# Altium project SensorsBoard.PrjPcb
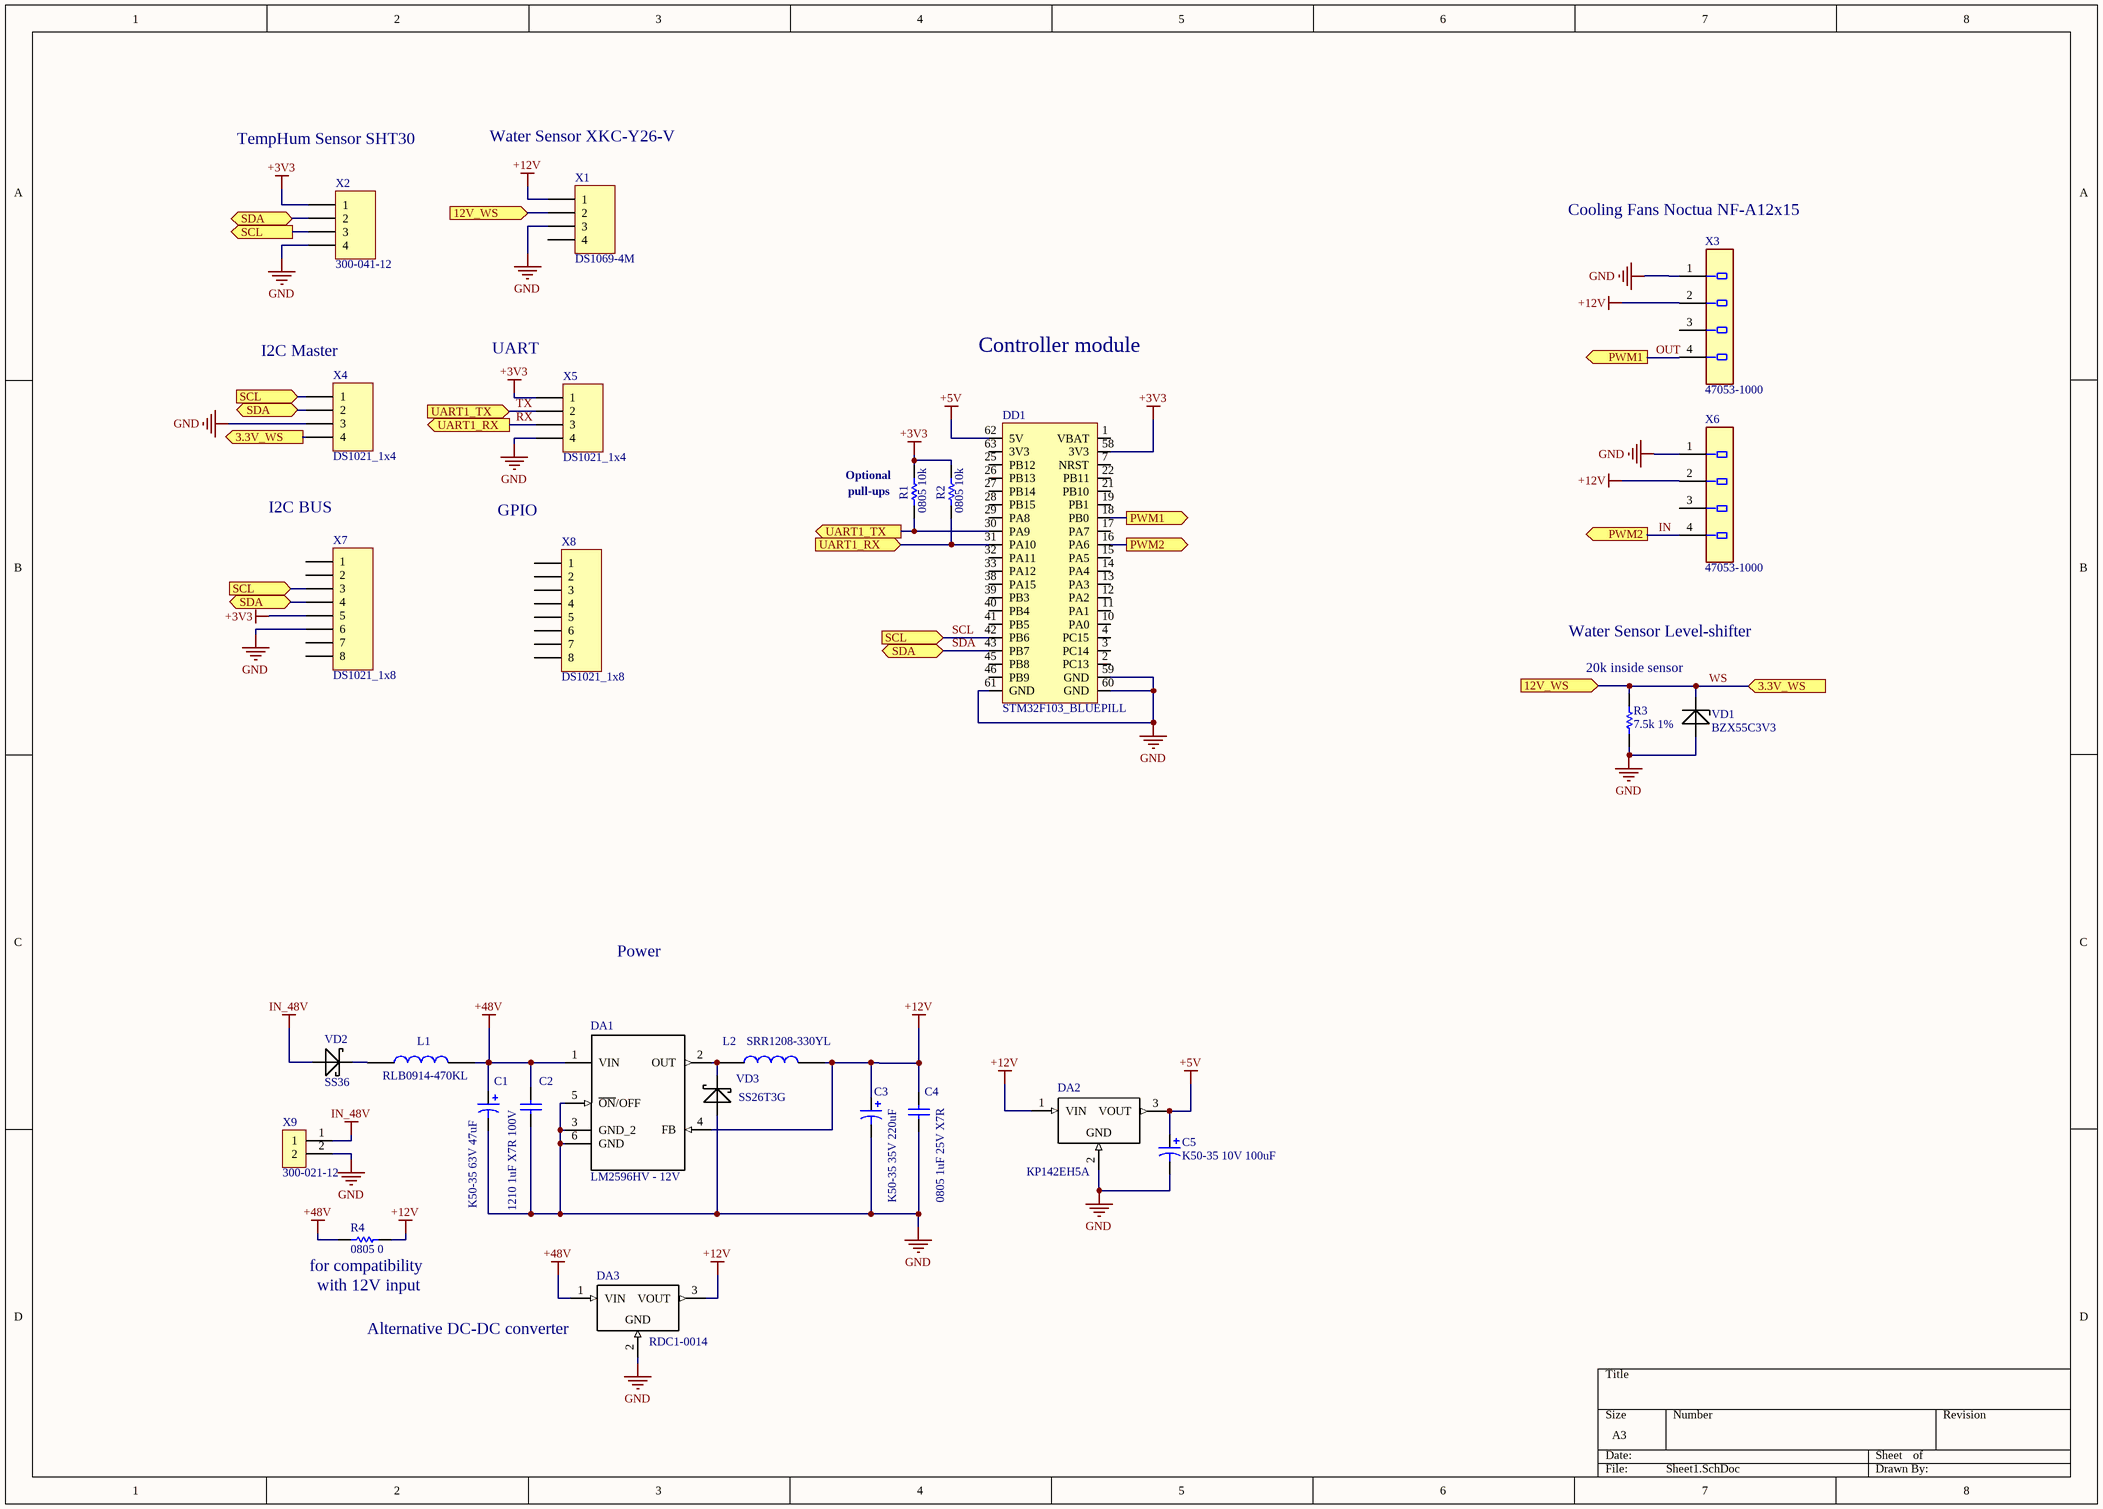
[diagram p0: Sheet1.SchDoc]
1 sheet, 27 parts. Net scope: flat (ports and power ports of the same name join across sheets).
Board files: PCB_THR.PcbDoc, PCB_DIY.PcbDoc, PCB_DIY_Board.PcbDoc

## Sheet Sheet1.SchDoc
size A3

### Parts
C1  K50-35 63V 47uF  [K50-35 6.3x11x2.5]
C2  1210 1uF X7R 100V  [C_SMD1210]
C3  K50-35 35V 220uF  [K50-35 8x11.5x3.5]
C4  0805 1uF 25V X7R  [C_SMD0805]
C5  K50-35 10V 100uF  [K50-35 5x11x2]
DA1  LM2596HV - 12V  [TO263-5 - heatsink]
DA2  КР142ЕН5А  [TO-220-short]
DA3  RDC1-0014  [RDC1-0014]
DD1  STM32F103_BLUEPILL  [STM32F103_BLUEPILL]
L1  RLB0914-470KL  [RLB0914]
L2  SRR1208-330YL  [SRR1208]
R1  0805 10k  [R_SMD0805]
R2  0805 10k  [R_SMD0805]
R3  7.5k 1%  [THROU_HOLE2.54]
R4  0805 0  [R_SMD0805]
VD1  BZX55C3V3  [THROU_HOLE2.54]
VD2  SS36  [DO214AB SMC]
VD3  SS26T3G  [DO-214AA]
X1  DS1069-4M  [DS1069-4 CWF-4 CONNFLY]
X2  300-041-12  [300-041-12]
X3  Part Number: 47053-1000  [Molex_47053-1000_0]  (hidden comment: Conn_Molex_47053-1000_eec)
X4  DS1021_1x4  [PLD1X4]
X5  DS1021_1x4  [PLD1X4]
X6  Part Number: 47053-1000  [Molex_47053-1000_0]
X7  DS1021_1x8  [PLD1x8]
X8  DS1021_1x8  [PLD1x8]
X9  300-021-12  [300-021-12]

### Ports
3.3V_WS (in), 3.3V_WS (out), 12V_WS (in), PWM1 (out), PWM2 (out), SCL (in), SCL (out), SDA (bidir), UART1_RX (in), UART1_RX (out), UART1_TX (in), UART1_TX (out)

### Nets
+3V3: DD1.58(3V3) R1.1 R2.1 X2.1 X5.1 X7.5
+5V: C5.1 DA2.3(VOUT) DD1.62(5V)
+12V: C3.1 C4.2 DA1.4(FB) DA2.1(VIN) DA3.3(VOUT) L2.2 R4.1 X1.1 X3.2 X6.2
+48V: C1.1 C2.2 DA1.1(VIN) DA3.1(VIN) L1.2 R4.2
GND: C1.2 C2.1 C3.2 C4.1 C5.2 DA1.3(GND_2) DA1.5(~{ON}/OFF) DA1.6(GND) DA2.2(GND) DA3.2(GND) DD1.59(GND) DD1.60(GND) DD1.61(GND) R3.1 VD1.1(POS) VD3.2(POS) X1.3 X2.4 X3.1 X4.3 X5.4 X6.1 X7.6 X9.2
IN_48V: VD2.1(POS) X9.1
IN: DD1.16(PA6) X6.4 ; port PWM2
OUT: DD1.18(PB0) X3.4 ; port PWM1
RX: DD1.31(PA10) R2.2 X5.3 ; port UART1_RX
SCL: DD1.42(PB6) X2.3 X4.1 X7.3 ; port SCL
SDA: DD1.43(PB7) X2.2 X4.2 X7.4 ; port SDA
TX: DD1.30(PA9) R1.2 X5.2 ; port UART1_TX
WS: R3.2 VD1.2(NEG) X1.2 X4.4 ; port 12V_WS, port 3.3V_WS
NetDA1_2: DA1.2(OUT) L2.1 VD3.1(NEG)
NetL1_1: L1.1 VD2.2(NEG)

Not connected (* = marked no-connect by the designer): DD1 1(VBAT) 2(PC13) 3(PC14) 4(PC15) 7(NRST) 10(PA0) 11(PA1) 12(PA2) 13(PA3) 14(PA4) 15(PA5) 17(PA7) 19(PB1) 21(PB10) 22(PB11) 25(PB12) 26(PB13) 27(PB14) 28(PB15) 29(PA8) 32(PA11) 33(PA12) 38(PA15) 39(PB3) 40(PB4) 41(PB5) 45(PB8) 46(PB9) 63(3V3); X1 4; X3 3; X6 3; X7 1 2 7 8; X8 1 2 3 4 5 6 7 8

### Notes on the sheet
- TempHum Sensor SHT30
- (near X1) Water Sensor XKC-Y26-V
- Cooling Fans Noctua NF-A12x15
- (near X4) I2C Master
- (near X5) UART
- Controller module
- I2C BUS
- GPIO
- (near R1) Optional
- (near R1) pull-ups
- Water Sensor Level-shifter
- 20k inside sensor
- Power
- (near R4) for compatibility
- (near R4) with 12V input
- (near DA3) Alternative DC-DC converter

### Library data of the parts
C1 C3 C5 = K50-35mini: Конденсатор электролитический алюминиевый
C2 = C1210: Cap SMD1210
C4 = C0805: SMD Cap 0805
DA1 = LM2596HV: SIMPLE SWITCHER4; 4V to 60V, 3A Low Component Count Step-Down Regulator
DA2 = КР142ЕН5А: Cтабилизатор напряжения положительной полярности с выходным / напряжением 5 В
DA3 = RDC1-0014: Встраиваемый DC/DC преобразователь 60В 3А
L1 = RLB0914: Радиальные выводные индуктивности / Диапазон рабочих температур –20 °С… +80 °С. / Рост температуры в процессе эксплуатации, не более 20 °С. / Диапазон индуктивностей 1 - 82000 мкГ
L2 = SRR1208-682KL: Fixed Inductors 6800uH 10% SMD 1208
R1 R2 R4 = R0805: SMD Res 0805
R3 = RES_THROUHOLE: Throu hole resistor
VD1 = BZX55C3V3: Stabilitron 3.3V
VD2 = SS36: Rectifier, Schottky; DO-214AB; 3.0A IF; 0.75V; 60V; 100A IFRM; 10000V/us; 1000pF
VD3 = SS26T3G: Диод Шоттки 2А 60В [SMB / DO-214AA]
X1 = DS1069-4: Вилка на плату 2.50мм
X2 = 300-041-12: Клеммник винтовой, 4-контактный, 5мм, прямой
X3 = Conn_Molex_47053-1000_eec: CONN 4 Positions Header, Unshrouded Connector 0.100" (2.54mm) Through Hole Tin; Manufacturer: Molex; Voltage: 250V; Current: 4.0A; helpURL: https://upverter.com/upn/revision/17f438354fec4bac/; ComponentLink2Description: Datasheet; Temperature: 0°C to +75°C; Package: CONN_4P254L; Supplier 2: Mouser; Supplier 1: Digi-Key; ComponentLink1URL: https://upverter.com/upn/revision/17f438354fec4bac/; Supplier Part Number 2: 538-47053-1000; Supplier Part Number 1: WM4330-ND; ComponentLink1Description: Upverter; ComponentLink2URL: http://www.molex.com/webdocs/datasheets/pdf/en-us//0470531000_PCB_HEADERS.pdf; RoHS: TRUE; Mouser Part Number: 538-47053-1000; Ipc Land Pattern Name: HDRV4W65P_1X4_1020X65X1350; Temperature Range High: +75°C; Digikey Description: CONN 4 Positions Header, Unshrouded Connector 0.100" (2.54mm) Through Hole Tin; Digikey Part Number: WM4330-ND; Temperature Range Low: 0°C; Lead Free: yes; Contact Type: Male Pin; Mounting Style: Through Hole; Pitch: 2.54mm
X4 X5 = DS1021_1x4: Вилка штыревая 2.54мм 1x4 прямая тип1
X6 = 47053-1000: CONN 4 Positions Header, Unshrouded Connector 0.100" (2.54mm) Through Hole Tin; Manufacturer: Molex; Voltage: 250V; Current: 4.0A; helpURL: https://upverter.com/upn/revision/17f438354fec4bac/; ComponentLink2Description: Datasheet; Temperature: 0°C to +75°C; Package: CONN_4P254L; Supplier 2: Mouser; Supplier 1: Digi-Key; ComponentLink1URL: https://upverter.com/upn/revision/17f438354fec4bac/; Supplier Part Number 2: 538-47053-1000; Supplier Part Number 1: WM4330-ND; ComponentLink1Description: Upverter; ComponentLink2URL: http://www.molex.com/webdocs/datasheets/pdf/en-us//0470531000_PCB_HEADERS.pdf; RoHS: TRUE; Mouser Part Number: 538-47053-1000; Ipc Land Pattern Name: HDRV4W65P_1X4_1020X65X1350; Temperature Range High: +75°C; Digikey Description: CONN 4 Positions Header, Unshrouded Connector 0.100" (2.54mm) Through Hole Tin; Digikey Part Number: WM4330-ND; Temperature Range Low: 0°C; Lead Free: yes; Contact Type: Male Pin; Mounting Style: Through Hole; Pitch: 2.54mm
X7 X8 = DS1021_1x8: Вилка штыревая 2.54мм 1x8 прямая тип1
X9 = 300-021-12: Klemmnik 2